# EAGLE design Duinopeak-Mazebot-v0.1 (EAGLE 6.6.0)
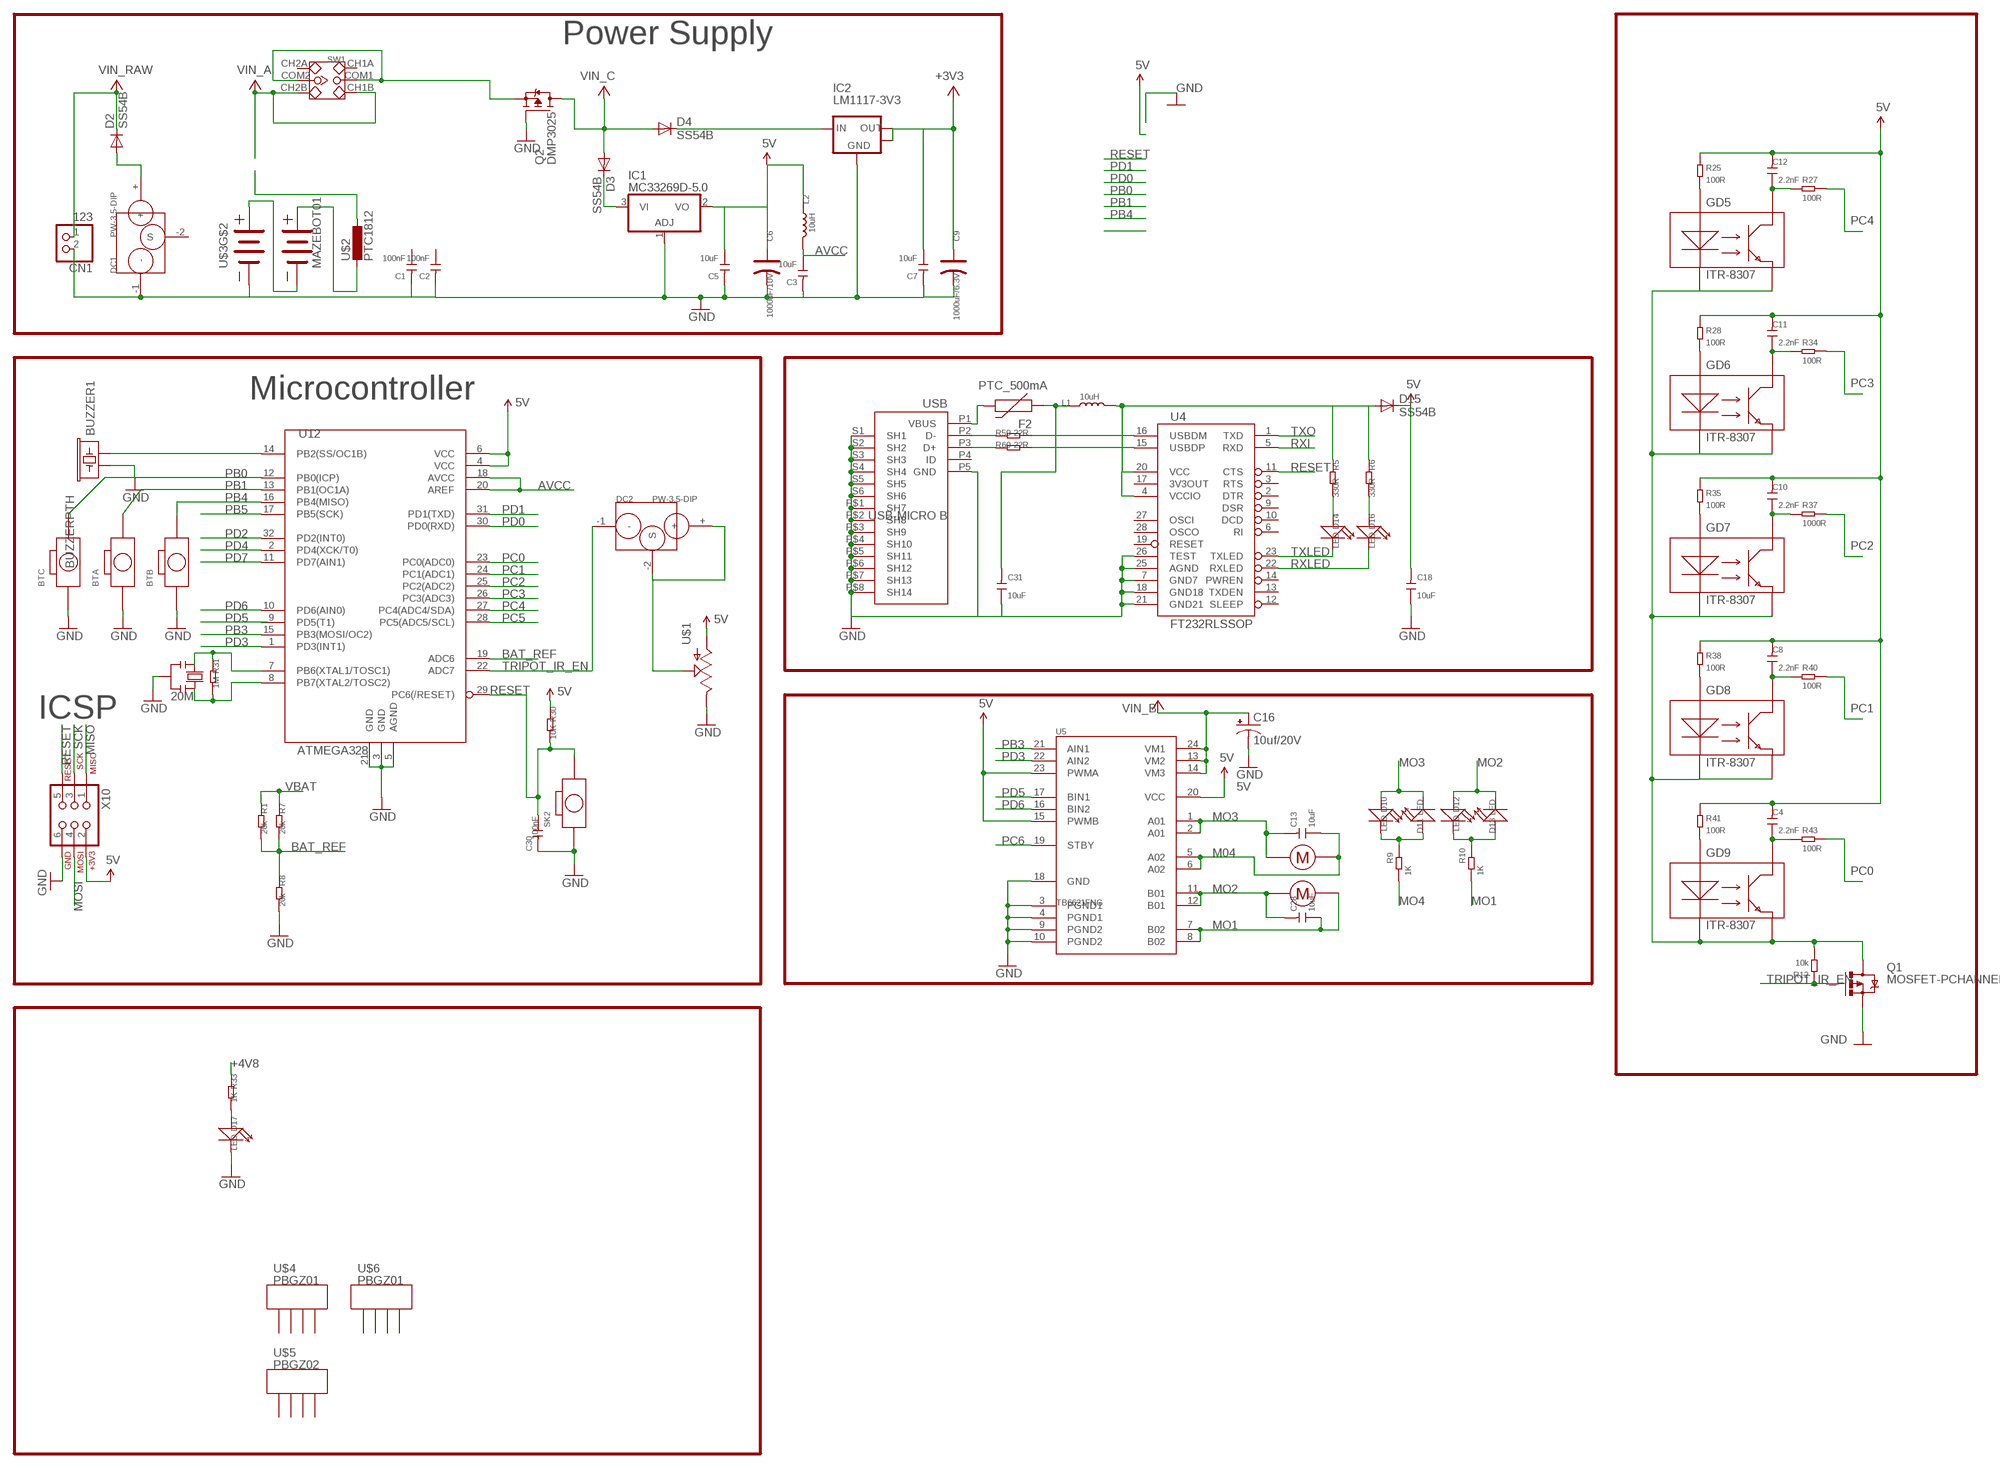
[diagram p0: schematic, sheet 1]

## Parts
BTA  BOTTON-2P-90  [2P-7.62X3.56-90D]
BTB  BOTTON-2P-90  [2P-7.62X3.56-90D]
BTC  BOTTON-2P-90  [2P-7.62X3.56-90D]
BUZZER1  BUZZERPTH  [BUZZER-12MM]
C1  100nF  C-0603  [C0603]
C2  100nF  C-0603  [C0603]
C3  10uF  C-0805  [C0805]
C4  2.2nF  C-0603  [C0603]
C5  10uF  C-0805  [C0805]
C6  1000uF/10V  CAP-D8.2/3.05  [ELECTRO-8.2MM]
C7  10uF  C-0805  [C0805]
C8  2.2nF  C-0603  [C0603]
C9  1000uF/6.3V  CAP-D8.2/3.05  [ELECTRO-8.2MM]
C10  2.2nF  C-0603  [C0603]
C11  2.2nF  C-0603  [C0603]
C12  2.2nF  C-0603  [C0603]
C13  10uF  C-0805  [C0805]
C16  10uf/20V  CAP_POL1206  [EIA3216]
C18  10uF  C-0603  [C0603]
C28  10uF  C-0805  [C0805]
C30  100nF  C-0603  [C0603]
C31  10uF  C-0805  [C0805]
CN1  123  JST_2PIN-SMT-RA  [JST-PH-2-SMT-RA]
D2  SS54B  DIODE-SMB  [SMB]
D3  SS54B  DIODE-SMB  [SMB]
D4  SS54B  DIODE-SMB  [SMB]
D10  LED  LED'0603'  [LED-0603]
D11  LED  LED'0603'  [LED-0603]
D12  LED  LED'0603'  [LED-0603]
D13  LED  LED'0603'  [LED-0603]
D14  LED  LED'0603'  [LED-0603]
D15  SS54B  DIODE-SMB  [SMB]
D16  LED  LED'0603'  [LED-0603]
D17  LED  LED'0603'  [LED-0603]
DC1  PW-3.5-DIP  [PW-3.5-DIP]
DC2  PW-3.5-DIP  [PW-3.5-DIP]
F2  PTC_500mA  PTCSMD  [PTC-1206]
GD5  ITR-8307  [ITR-8307]
GD6  ITR-8307  [ITR-8307]
GD7  ITR-8307  [ITR-8307]
GD8  ITR-8307  [ITR-8307]
GD9  ITR-8307  [ITR-8307]
IC1  MC33269D-5.0  MC33269D  [DPACK]
IC2  LM1117-3V3  LM1117-SOT223  [SOT223]
L1  10uH  L'0805'  [L0805]
L2  10uH  L'0805'  [L0805]
Q1  MOSFET-PCHANNEL  [SOT23]
Q2  DMP3025  SPD30P06PTO252  [TO252]
R1  20k  R-0603  [R0603]
R5  330R  R-0603  [R0603]
R6  330R  R-0603  [R0603]
R7  20k  R-0603  [R0603]
R8  20k  R-0603  [R0603]
R9  1K  R-0603  [R0603]
R10  1K  R-0603  [R0603]
R12  10k  R-0603  [R0603]
R25  100R  R-0603  [R0603]
R27  100R  R-0603  [R0603]
R28  100R  R-0603  [R0603]
R30  10K  R-0603  [R0603]
R31  1M  R-0603  [R0603]
R33  1K  R-0603  [R0603]
R34  100R  R-0603  [R0603]
R35  100R  R-0603  [R0603]
R37  1000R  R-0603  [R0603]
R38  100R  R-0603  [R0603]
R40  100R  R-0603  [R0603]
R41  100R  R-0603  [R0603]
R43  100R  R-0603  [R0603]
R59  22R  R-0603  [R0603]
R60  22R  R-0603  [R0603]
SK2  BOTTON-2P-90  [2P-7.62X3.56-90D]
SW1  SWITCH-2CH-6P'90D'  [6P-2CH-2.54-9.0X3.6-90D]
U4  FT232RLSSOP  [SSOP28DB]
U5  TB6621FNG  [SSOP24]
U12  ATMEGA328  ATMEGA168  [TQFP32-08]
U$1  POTTRIM  [TRIM_POT]
U$2  PTC1812  [PTC-L1812]
U$3  MAZEBOT01  [MAZEBOT-P1]
U$4  PBGZ01  [PBGZ-22X33MM]
U$5  PBGZ02  [PBGZ-20X55MM]
U$6  PBGZ01  [PBGZ-22X33MM]
USB  USB-MICRO B  MYCON2_USB-MINI-B  [CON2_USB_MICRO_B_AT]
X10  AVR_SPI_PRG_62X3_LOCK  [2X3_LOCK]
Y1  20M  RESONATORMU  [RESONATOR]

## Nets
5V: C4.2 C5.1 C6.1(+) C8.2 C10.2 C11.2 C12.2 C18.2 D15.C IC1.2(VO) L2.1 R25.1 R28.1 R30.1 R35.1 R38.1 R41.1 U5.15(PWMB) U5.20(VCC) U5.23(PWMA) U12.4(VCC) U12.6(VCC) U$1.3(A) X10.2
+3V3: C7.1 C9.1(+) IC2.2(OUT) IC2.4(OUT)
+4V8: R33.1
AVCC: C3.1 L2.2 U12.18(AVCC) U12.20(AREF)
BAT_REF: R1.2 R7.2 R8.1 U12.19(ADC6)
DCA: CN1.1 D2.C ; supply symbol labelled VIN_RAW
DCB: SW1.CH1B SW1.CH2B ; supply symbol labelled VIN_A
GND: BTA.P$1 BTB.P$1 BTC.P$1 BUZZER1.+ C1.2 C2.2 C3.2 C5.2 C6.2(-) C7.2 C9.2(-) C16.C(-) C18.1 C30.2 C31.1 CN1.2 D17.- DC1.-1(-) IC1.1(ADJ) IC2.1(GND) Q1.2(S) Q2.1(G) R8.2 SK2.P$1 U4.7(GND7) U4.18(GND18) U4.21(GND21) U4.25(AGND) U4.26(TEST) U5.3(PGND1) U5.4(PGND1) U5.9(PGND2) U5.10(PGND2) U5.18(GND) U12.3(GND) U12.5(AGND) U12.21(GND) U$1.2(E) U$3.D1 USB.P5(GND) USB.P$1(SH7) USB.P$2(SH8) USB.P$3(SH9) USB.P$4(SH10) USB.P$5(SH11) USB.P$6(SH12) USB.P$7(SH13) USB.P$8(SH14) USB.S1(SH1) USB.S2(SH2) USB.S3(SH3) USB.S4(SH4) USB.S5(SH5) USB.S6(SH6) X10.6 Y1.2
M04: C13.1 U5.5(A02) U5.6(A02) U$3.M2
MISO: X10.1
MO1: C28.1 R10.2 U5.7(B02) U5.8(B02) U$3.M4
MO2: C28.2 D12.+ D13.- U5.11(B01) U5.12(B01) U$3.M3
MO3: C13.2 D10.+ D11.- U5.1(A01) U5.2(A01) U$3.M1
MO4: R9.2
MOSI: X10.4
N$2: R31.1 U12.7(PB6(XTAL1/TOSC1)) Y1.1
N$3: R31.2 U12.8(PB7(XTAL2/TOSC2)) Y1.3
N$4: D14.+ R5.2
N$5: D16.+ R6.2
N$6: D10.- D11.+ R9.1
N$7: D17.+ R33.2
N$8: C31.2 F2.1 L1.1
N$9: GD5.2 GD5.4 GD6.2 GD6.4 GD7.2 GD7.4 GD8.2 GD8.4 GD9.2 GD9.4 Q1.3(D) R12.2
N$10: DC2.+ DC2.-2(S) U$1.1(S)
N$11: BUZZER1.- U12.14(PB2(SS/OC1B))
N$13: D12.- D13.+ R10.1
N$20: C12.1 GD5.3 R27.2
N$21: U$3.D2 U$3.D3
N$22: U$2.1 U$3.D4
N$28: D4.C IC2.3(IN)
N$30: D3.C IC1.3(VI)
N$32: F2.2 USB.P1(VBUS)
N$33: R59.1 USB.P2(D-)
N$34: GD5.1 R25.2
N$35: GD6.1 R28.2
N$36: C10.1 GD7.3 R37.2
N$40: GD7.1 R35.2
N$46: C8.1 GD8.3 R40.2
N$47: D15.A L1.2 R5.1 R6.1 U4.4(VCCIO) U4.20(VCC)
N$50: GD8.1 R38.2
N$51: C4.1 GD9.3 R43.2
N$55: GD9.1 R41.2
N$61: U$2.2
N$62: R60.1 USB.P3(D+)
N$66: D2.A DC1.+
N$73: C11.1 GD6.3 R34.2
PB0: BTC.P$2 U12.12(PB0(ICP))
PB1: BTA.P$2 U12.13(PB1(OC1A))
PB3: U5.21(AIN1) U12.15(PB3(MOSI/OC2))
PB4: BTB.P$2 U12.16(PB4(MISO))
PB5: U12.17(PB5(SCK))
PC0: R43.1 U12.23(PC0(ADC0))
PC1: R40.1 U12.24(PC1(ADC1))
PC2: R37.1 U12.25(PC2(ADC2))
PC3: R34.1 U12.26(PC3(ADC3))
PC4: R27.1 U12.27(PC4(ADC4/SDA))
PC5: U12.28(PC5(ADC5/SCL))
PC6: U5.19(STBY)
PD0: U12.30(PD0(RXD))
PD1: U12.31(PD1(TXD))
PD2: U12.32(PD2(INT0))
PD3: U5.22(AIN2) U12.1(PD3(INT1))
PD4: U12.2(PD4(XCK/T0))
PD5: U5.17(BIN1)
PD6: U5.16(BIN2) U12.10(PD6(AIN0))
PD7: U12.11(PD7(AIN1))
RESET: C30.1 R30.2 SK2.P$2 U4.11(CTS) U12.29(PC6(/RESET)) X10.5
RXI: U4.5(RXD)
RXLED: D16.- U4.22(RXLED)
SCK: X10.3
TRIPOT_IR_EN: DC2.-1(-) Q1.1(G) R12.1 U12.22(ADC7)
TXLED: D14.- U4.23(TXLED)
TXO: U4.1(TXD)
USB_D+: R60.2 U4.15(USBDP)
USB_D-: R59.2 U4.16(USBDM)
VBAT: R1.1 R7.1
VIN_B: Q2.2(S) SW1.COM1 SW1.COM2
VIN_C: C16.A(+) D3.A D4.A Q2.3(D) U5.13(VM2) U5.14(VM3) U5.24(VM1) ; supply symbol labelled VIN_B
Unconnected: C1.1 C2.1 DC1.-2(S) SW1.CH1A SW1.CH2A U4.2(DTR) U4.3(RTS) U4.6(RI) U4.9(DSR) U4.10(DCD) U4.12(SLEEP) U4.13(TXDEN) U4.14(PWREN) U4.17(3V3OUT) U4.19(RESET) U4.27(OSCI) U4.28(OSCO) U12.9(PD5(T1)) U$3.1(GND) U$3.2(+5V) U$3.3(+3.3V) U$3.4(RESET) U$3.5(TXD) U$3.6(RXD) U$3.7(PB2) U$3.8(MOSI) U$3.9(MISO) U$3.10(SCK) U$3.11(PC7) U$3.12(PC6) U$3.13(PC5) U$3.14(PC4) U$3.15(PC3) U$3.16(PC2) U$3.17(SDA) U$3.18(SCL) U$3.19(PA7) U$3.20(PD5) U$4.1 U$4.2 U$4.3 U$4.4 U$5.1 U$5.2 U$5.3 U$5.4 U$6.1 U$6.2 U$6.3 U$6.4 USB.P4(ID)

## Notes on the sheet
- Power Supply
- Microcontroller
- ICSP

## Library data of the parts
BTA BTB BTC SK2 = Seeedstudio-Discrete.rpt:BOTTON-2P
BUZZER1 = SparkFun:BUZZER: Buzzer 12mm Spark Fun Electronics SKU : Comp-Buzzer
C1-C5 C7 C8 C10-C13 C18 C28 C30 C31 = Discrete:C*: Ceramic Capacitors
C6 C9 = Discrete:CAP*: Electrolytic Capacitors,Tantalum Capacitors and Super Capacitors
C16 = SparkFun:CAP_POL: Capacitor Polarized These are standard SMD and PTH capacitors. Normally 10uF, 47uF, and 100uF in electrolytic and tantalum varieties. Always verify the external diameter of the through hole cap, it varies with capacity, voltage, and manufacturer. The EIA devices should be standard.
CN1 = adafruit:JST_2PIN: JST 2-Pin Connectors of various flavors SMT-RA (S2B-PH-SM4) 4UConnector #17311 SMT (B2B-PH-SM4) THM-RA (S2B-PH) THM (B2B-PH)
D2-D4 D15 = diode:DIODE-: DIODE
D10-D14 D16 D17 = Discrete:LED*
DC1 DC2 = arduino-QXZ:PW-3.5-DIP
F2 = SparkFun:PTC: Resettable Fuse PTC Resettable Fuse. Spark Fun Electronics SKU : COM-08357
GD5-GD9 = arduino-QXZ:ITR-8307
IC1 = linear:MC33269?*: Adjustable Output Low Dropout Voltage Regulator 800 mA Source: http://www.onsemi.com/pub/Collateral/MC33269-D.PDF
IC2 = TKJMixed:LM1117: Voltage Regulator LM1117 Standard adjustable voltage regulator but in SMD form. Spark Fun Electronics SKU : COM-00595
L1 L2 = Discrete:L*
Q1 = SparkFun:MOSFET-PCHANNEL
Q2 = transistor-fet:SPD30P06P: SIPMOS(R) Power-Transistor P-Channel, Enhancement mode Source: http://www.infineon.com/upload/Document/cmc_upload/documents/012/3615/SPD_U30P06P.pdf
R1 R5-R10 R12 R25 R27 R28 R30 R31 R33-R35 R37 R38 R40 R41 R43 R59 R60 = Discrete:R*
SW1 = Seeedstudio-Discrete.rpt:SWITCH-2CH-6P
U4 = SparkFun:FT232RL: USB UART FT232RL 4th Generation USB UART (USB <-> Serial) Controller. Spark Fun Electronics SKU : COM-00650
U5 = SparkFun:TB6621FNG: Toshiba 1A motor driver
U12 = SparkFun:ATMEGA168
U$1 = SparkFun:POT
U$2 = arduino-QXZ:PTC
U$3 = 元件库-模块板:MAZEBOT
U$4-U$6 = 元件库-main:PBGZ
USB = SmartPrj:MYCON2_USB-MINI-B
X10 = TKJMixed:AVR_SPI_PRG_6: AVR ISP 6 Pin This is the reduced ISP connector for AVR programming. Common on Arduino. This footprint will take up less PCB space and can be used with a 10-pin to 6-pin adapter such as SKU: BOB-08508
Y1 = SmartPrj:RESONATOR

## Net classes
0 default: width 0.203 mm
1 vcc: width 0.254 mm

## Board
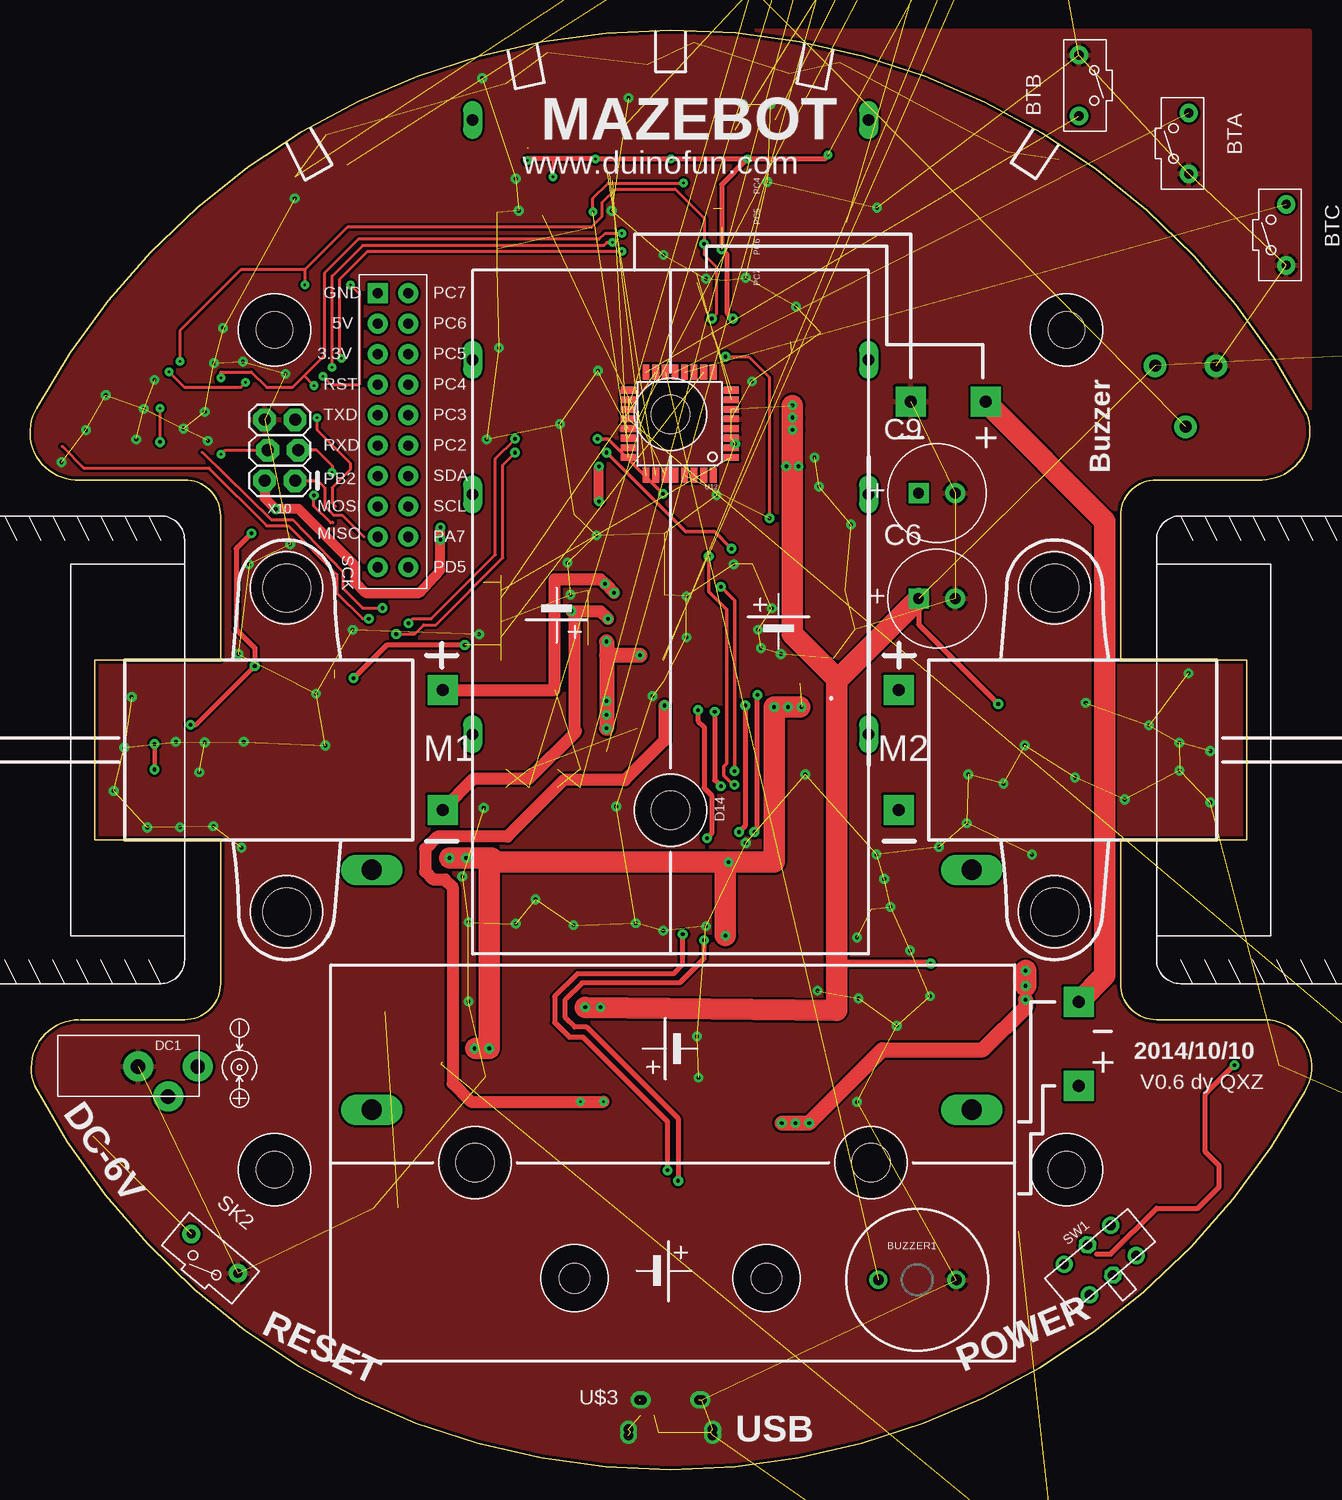
[diagram p1: board, top side]
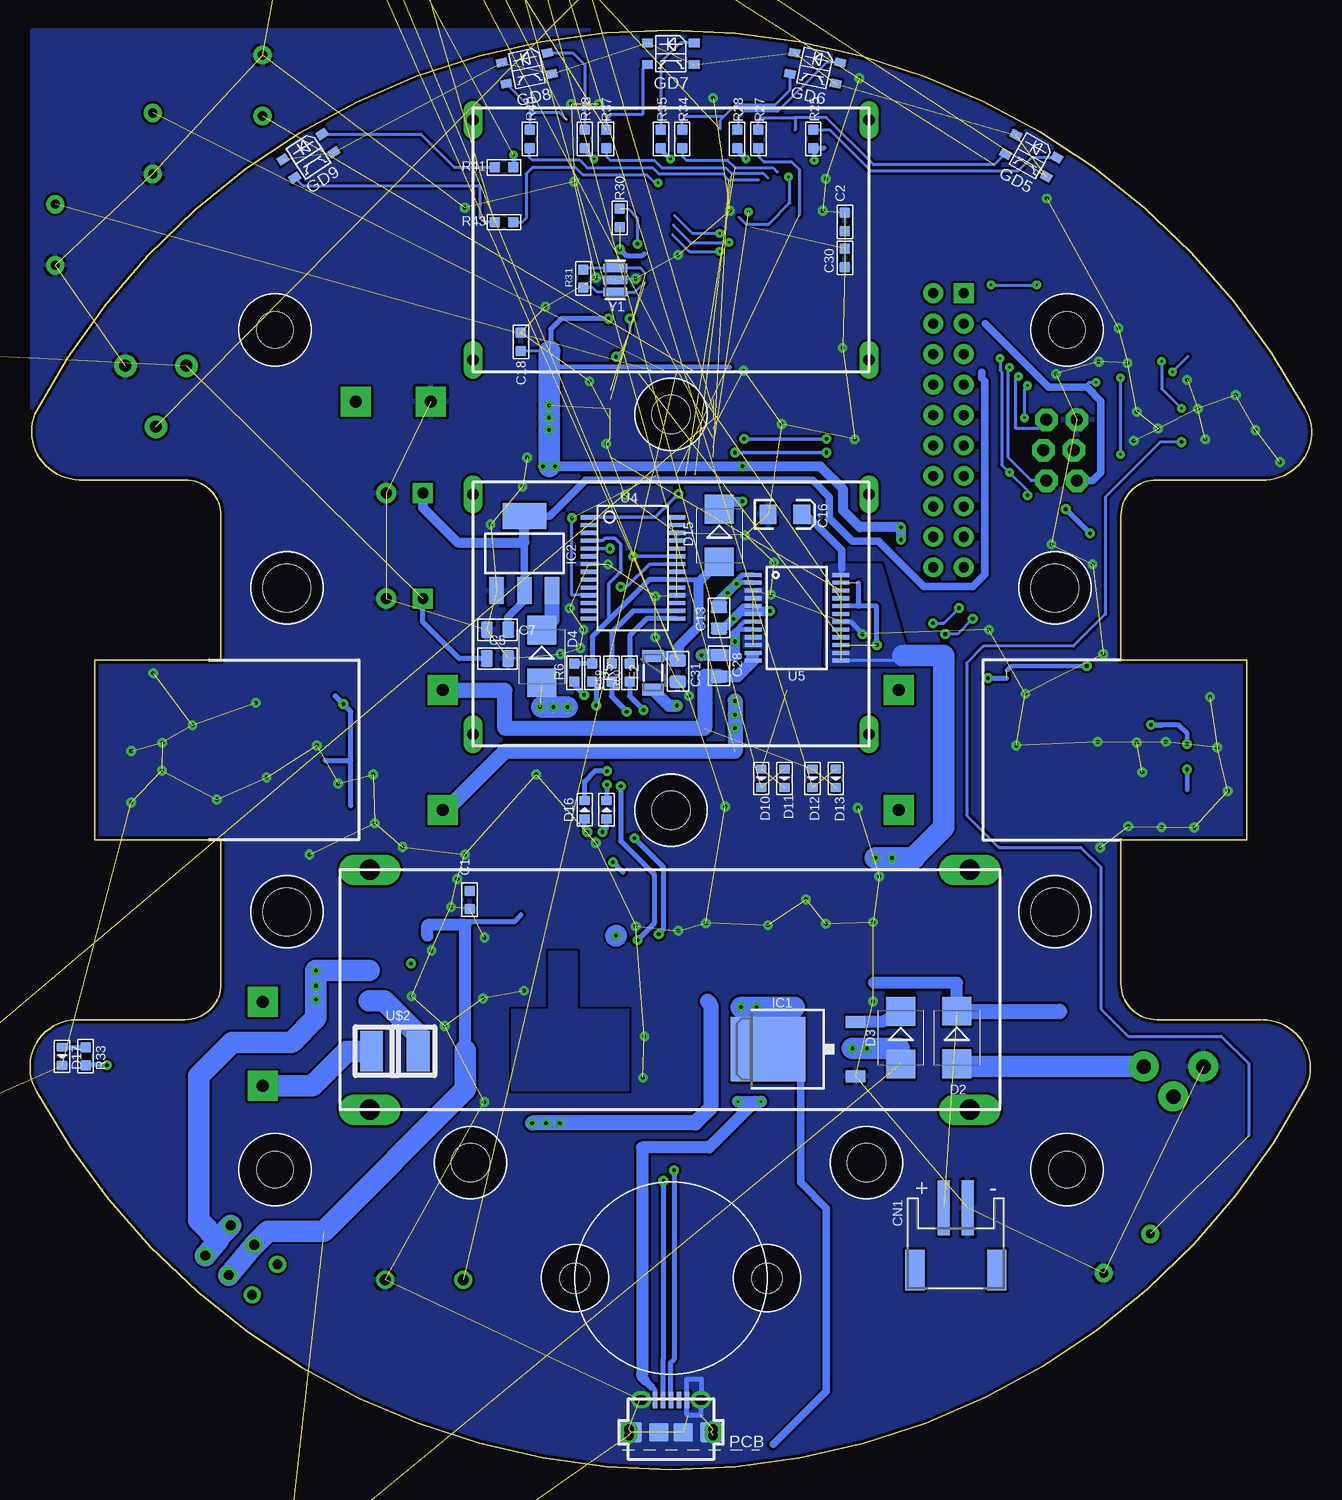
[diagram p2: board, bottom side, seen from below]

Size 106.79 x 120 mm. Coordinates in mm from the lower left corner, seen from the top.
Copper layers (1*16): Top 0.035mm / dielectric 1.5mm / Bottom 0.035mm
Design rules "Sparkfun *": minimum track width 10mil, minimum drill 12mil, track to track 8mil, track to pad 8mil, pad to pad 8mil, via to via 8mil, smd to smd 8mil, copper to edge 10mil, drill to drill 8mil, minimum pad ring 12mil, minimum via ring 10mil, stop-mask expansion 4mil, vias tented up to drill 25mil, thermal gap 10mil

### Footprints (pad centres in the part's own frame; a part is rotated, then mirrored left to right if it is on the bottom)
2P-7.62X3.56-90D = drill 0.762 pad 1.524: P$1 0,2.54; P$2 0,-2.54
BUZZER-12MM = drill 0.9: + 3.25,0; - -3.25,0
C0603 = smd 0.889 x 0.889: 1 -0.762,0; 2 0.762,0
C0805 = smd 1.016 x 1.397: 1 -0.889,0; 2 0.889,0
ELECTRO-8.2MM = drill 0.889 pad 1.651 square: 1 -1.524,0 | drill 0.889 pad 1.651: 2 1.524,0
EIA3216 = smd 1.4 x 1.6: A 1.4,0; C -1.4,0
JST-PH-2-SMT-RA = smd 1 x 4.6: 1 1,-3.7; 2 -1,-3.7 | smd 1.6 x 3.4: NC1 -3.4,1.5; NC2 3.4,1.5
SMB = smd 2.4 x 2.4: A 2.2,0; C -2.2,0
LED-0603 = smd 0.762 x 0.889: + -0.762,0; - 0.762,0
PW-3.5-DIP = drill 1.2 pad 2.5: + -0.025,0; -1 -5,0; -2 -2.5,-2.5
PTC-1206 = smd 1 x 1.8: 1 -1.4,0; 2 1.4,0
ITR-8307 = smd 0.9 x 0.7: 1 1.947,0.918; 2 -1.953,0.918; 3 -1.953,-0.882; 4 1.947,-0.882
DPACK = smd 1 x 1.6: 1 -2.28,-4.8; 3 2.28,-4.8 | smd 5.4 x 6.2: 2 0,2.5
SOT223 = smd 1.219 x 2.235: 1 -2.311,-3.099; 2 0,-3.099; 3 2.311,-3.099 | smd 3.6 x 2.2: 4 0,3.099
L0805 = smd 1.016 x 1.397: 1 -0.889,0; 2 0.889,0
SOT23 = smd 1 x 1.4: 1 -0.95,-1.1; 2 0.95,-1.1; 3 0,1.1
TO252 = smd 1 x 1.6: 1 -2.28,-4.8; 2 2.28,-4.8 | smd 5.4 x 6.2: 3 0,2.5
R0603 = smd 0.889 x 0.889: 1 -0.762,0; 2 0.762,0
6P-2CH-2.54-9.0X3.6-90D = drill 0.813 pad 1.27: CH1A -2.54,-1.65; CH1B 2.54,-1.65; CH2A -2.54,1.65; CH2B 2.54,1.65 | drill 0.813 pad 1.27 octagon: COM1 0,-1.65; COM2 0,1.65
SSOP28DB = smd 0.348 x 1.397: 1 -4.225,-3.656; 2 -3.575,-3.656; 3 -2.925,-3.656; 4 -2.275,-3.656; 5 -1.625,-3.656; 6 -0.975,-3.656; 7 -0.325,-3.656; 8 0.325,-3.656; 9 0.975,-3.656; 10 1.625,-3.656; 11 2.275,-3.656; 12 2.925,-3.656; 13 3.575,-3.656; 14 4.225,-3.656; 15 4.225,3.656; 16 3.575,3.656; 17 2.925,3.656; 18 2.275,3.656; 19 1.625,3.656; 20 0.975,3.656; 21 0.325,3.656; 22 -0.325,3.656; 23 -0.975,3.656; 24 -1.625,3.656; 25 -2.275,3.656; 26 -2.925,3.656; 27 -3.575,3.656; 28 -4.225,3.656
SSOP24 = smd 0.348 x 1.397: 1 -3.575,-3.656; 2 -2.925,-3.656; 3 -2.275,-3.656; 4 -1.625,-3.656; 5 -0.975,-3.656; 6 -0.325,-3.656; 7 0.325,-3.656; 8 0.975,-3.656; 9 1.625,-3.656; 10 2.275,-3.656; 11 2.925,-3.656; 12 3.575,-3.656; 13 3.575,3.656; 14 2.925,3.656; 15 2.275,3.656; 16 1.625,3.656; 17 0.975,3.656; 18 0.325,3.656; 19 -0.325,3.656; 20 -0.975,3.656; 21 -1.625,3.656; 22 -2.275,3.656; 23 -2.925,3.656; 24 -3.575,3.656
TQFP32-08 = smd 1.27 x 0.559: 1 -4.293,2.8; 2 -4.293,2; 3 -4.293,1.2; 4 -4.293,0.4; 5 -4.293,-0.4; 6 -4.293,-1.2; 7 -4.293,-2; 8 -4.293,-2.8; 17 4.293,-2.8; 18 4.293,-2; 19 4.293,-1.2; 20 4.293,-0.4; 21 4.293,0.4; 22 4.293,1.2; 23 4.293,2; 24 4.293,2.8 | smd 0.559 x 1.27: 9 -2.8,-4.293; 10 -2,-4.293; 11 -1.2,-4.293; 12 -0.4,-4.293; 13 0.4,-4.293; 14 1.2,-4.293; 15 2,-4.293; 16 2.8,-4.293; 25 2.8,4.293; 26 2,4.293; 27 1.2,4.293; 28 0.4,4.293; 29 -0.4,4.293; 30 -1.2,4.293; 31 -2,4.293; 32 -2.8,4.293
TRIM_POT = drill 1 pad 1.88: 1 5.08,0; 2 0,2.54; 3 0,-2.54
PTC-L1812 = smd 1.9 x 3.4: 1 -1.95,0; 2 1.95,0
MAZEBOT-P1 = drill 0.838 pad 1.651 square: 1 -24.396,38.068 | drill 0.838 pad 1.651: 2 -24.396,35.528; 3 -24.396,32.988; 4 -24.396,30.448; 5 -24.396,27.908; 6 -24.396,25.368; 7 -24.396,22.828; 8 -24.396,20.288; 9 -24.396,17.748; 10 -24.396,15.208; 11 -21.856,38.068; 12 -21.856,35.528; 13 -21.856,32.988; 14 -21.856,30.448; 15 -21.856,27.908; 16 -21.856,25.368; 17 -21.856,22.828; 18 -21.856,20.288; 19 -21.856,17.748; 20 -21.856,15.208 | drill 1 pad 2.5 square: D1 20,29.016; D2 26.254,29.016; D3 34,-21; D4 34,-28; M1 -19,5; M2 -19,-5; M3 19,5; M4 19,-5 | hole 4: 32.01,13.48; 32.01,-13.52; -31.99,-13.52; -31.99,13.48 | hole 3: -33,35; 33,35; 33,-35; -33,-35 | hole 3.2: -16.3,-34.43; 16.7,-34.43; 0,-5.04; 0,27.96 | hole 2.5: -8,-44.052; 8,-44.052
PBGZ-22X33MM = drill 0.965 pad 1.27 long: 1 0,21; 2 0,1; 3 33,1; 4 33,21
PBGZ-20X55MM = drill 1.7 pad 2.2 long: 1 2.5,0; 2 2.5,20; 3 52.5,20; 4 52.5,0
CON2_USB_MICRO_B_AT = smd 0.406 x 1.346: P1 -1.321,2.692; P2 -0.66,2.692; P3 0,2.692; P4 0.66,2.692; P5 1.321,2.692 | drill 0.8 pad 1.27: P$1 -2.616,2.692 | drill 0.8 pad 1.245: P$2 -2.362,2.692; P$7 2.362,2.692; P$8 2.616,2.692 | drill 0.8 pad 1.143: P$3 -3.505,-0.254; P$4 -3.505,0.254; P$5 3.505,0.254; P$6 3.505,-0.254 | smd 1.778 x 1.651: S1 -3.302,0; S2 3.302,0 | smd 1.524 x 1.27: S3 -2.489,2.692; S4 2.489,2.692 | smd 1.626 x 1.524: S5 -1.016,0; S6 1.016,0
2X3_LOCK = drill 1.016 pad 1.88 octagon: 1 0,0; 2 0,2.54; 3 2.54,-0.254; 4 2.54,2.286; 5 5.08,0; 6 5.08,2.54
RESONATOR = smd 0.7 x 2: 1 -1,0; 2 0,0; 3 1,0

### Placement (x,y rotation side)
BTA  96.56,110.55 180 top
BTB  87.41,115.37 0 top
BTC  104.69,102.93 180 top
BUZZER1  73.95,15.8 0 top
C1  70.16,47.48 270 bottom
C2  38.88,104 90 bottom
C3  126.53,23.42 0 top  (outside the outline)
C4  85.38,161.09 0 top  (outside the outline)
C5  67.84,67.6 0 bottom
C6  75.58,72.6 0 top
C7  67.83,70.01 180 bottom
C8  85.38,157.28 0 top  (outside the outline)
C9  75.58,81.4 0 top
C10  85.38,153.47 0 top  (outside the outline)
C11  85.38,149.66 0 top  (outside the outline)
C12  85.38,145.85 0 top  (outside the outline)
C13  49.38,71 90 bottom
C16  43.89,79.63 0 bottom
C18  65.88,94 270 bottom
C28  49.38,67 270 bottom
C30  38.88,101 270 bottom
C31  52.81,66.56 90 bottom
CN1  29.64,18.12 180 bottom
D2  29.56,36 270 bottom
D3  34.24,36 270 bottom
D4  64.15,67.78 270 bottom
D10  45.86,57.62 270 bottom
D11  43.92,57.62 270 bottom
D12  41.58,57.62 270 bottom
D13  39.65,57.62 270 bottom
D14  58.75,55 90 bottom
D15  49.36,77.86 270 bottom
D16  60.57,55 90 bottom
D17  104.12,34.45 270 bottom
DC1  14.01,33.58 0 top
DC2  35.09,148.9 0 top  (outside the outline)
F2  54.89,66.42 270 bottom
GD5  23.38,109.5 331 bottom
GD6  41.38,116.8 348 bottom
GD7  53.38,118 0 bottom
GD8  65.38,116.8 12 bottom
GD9  83.58,109.5 33 bottom
IC1  42.8,35.04 90 bottom
IC2  65.59,76.38 0 bottom
L1  82.84,137.72 0 top  (outside the outline)
L2  124.24,93.53 0 top  (outside the outline)
Q1  81.57,145.85 0 top  (outside the outline)
Q2  83.86,-9.6 0 top  (outside the outline)
R1  85.38,211.64 0 top  (outside the outline)
R5  59.93,66.43 270 bottom
R6  61.43,66.43 270 bottom
R7  85.38,207.83 0 top  (outside the outline)
R8  85.38,204.02 0 top  (outside the outline)
R9  85.38,200.21 0 top  (outside the outline)
R10  85.38,196.4 0 top  (outside the outline)
R12  82.33,142.04 0 top  (outside the outline)
R25  41.52,110.91 90 bottom
R27  46.09,110.91 90 bottom
R28  47.87,110.91 90 bottom
R30  57.64,104.34 90 bottom
R31  60.69,99.28 270 bottom
R33  102.16,34.45 90 bottom
R34  52.44,110.91 90 bottom
R35  54.22,110.91 90 bottom
R37  58.79,110.91 90 bottom
R38  60.57,110.91 90 bottom
R40  65.14,110.91 90 bottom
R41  67.29,108.55 180 bottom
R43  67.29,103.97 180 bottom
R59  58.33,66.43 90 bottom
R60  56.83,66.43 90 bottom
SK2  15.38,18 230 top
SW1  89.18,17.46 40 top
U4  56.56,75.16 270 bottom
U5  42.88,71 270 bottom
U12  54.14,87.18 180 top
U$1  96.3,92 270 top
U$2  76.38,34.87 0 bottom
U$3  53.38,60 0 top
U$4  36.88,113.5 180 bottom
U$5  25.98,50 180 bottom
U$6  36.88,82.3 180 bottom
USB  53.38,3.1 0 bottom
X10  22.1,82.43 90 top
Y1  58.02,99.15 270 bottom

### Tracks (layer width: path | path; a pad name or v marks a point on that pad's centre or on a via)
5V  (via drill 0.2, 0.2 pad 0.3, 0.3, 0.3 pad 0.41)  (15 unrouted)
  Top 0.254: 41.44,109.25 v41.44,109.12 | v43.6,107.75 43.6,109.25 | v11.6,91.5 12.87,90.23 17.56,90.23 v17.95,90.61
  Top 0.381: v10.38,60.48 v10.38,58.35 | v18.73,66.98 13.83,62.08 v13.37,62.08
  Top 0.406: 41.44,109.25 43.6,109.25 v47.13,109.25 v53.43,109.25 v59.78,109.25 | v59.78,109.25 66.23,109.25 66.48,109.5 v66.48,109.58 | v36.23,68.72 29.72,68.72 v26.96,65.97 | C6.1 74.05,70.44 v80.68,63.81 | v58.59,95.94 58.08,96.45 58.08,101.29 v57.64,101.73 57.64,107.11 v59.78,109.25 | v18.45,78.03 17.18,76.76 17.18,70.03 18.73,68.48 v18.73,66.98
  Top 0.61: v75.05,42.18 67.56,42.18 arc90 67.22,41.84
  Top 0.813: X10.2 19.56,81 v20.49,80.07 22.39,80.07 27.09,75.37 27.09,73.97 27.98,73.08 32.42,73.08 34.2,74.99 v34.2,77.53 v34.2,78.54 | v47.41,80.7 v47.41,83.62
  Top 1.778: v46.27,38.54 67.22,38.28 67.22,41.84 67.22,65.77 67.32,65.87 | 67.32,65.87 C6.1 | v63.54,88.7 v63.54,87.69 v63.54,86.67 63.54,69.65 67.32,65.87
  Bottom 0.254: 47.87,109.99 R28.1 | 66.48,108.59 R41.1 | R38.1 60.57,110.04 | R35.1 54.22,110.04 | 47.71,104.37 47.16,103.81 45.25,103.81 43.47,105.59 43.47,107.62 v43.6,107.75 | 63.48,93.24 C18.2 | 10.31,92.78 v11.6,91.5 | v17.95,90.61 18.58,90.61 18.96,90.23
  Bottom 0.381: 10.38,61.34 v10.38,60.48 | v10.38,58.35 10.38,56.66 | 25.38,66.66 25.36,66.66 25.03,66.98 v18.73,66.98
  Bottom 0.406: R25.1 40.64,110.15 | 41.44,110.15 v41.44,109.12 | v47.13,109.25 47.87,109.99 | v66.48,109.58 66.48,108.59 | 60.57,110.04 v59.78,109.25 | 54.22,110.04 v53.43,109.25 | C5.1 71.01,67.6 74.05,70.64 C6.1 | v36.23,68.72 36.23,71.97 37.76,71.97 | 37.76,71.97 U5.20 | 37.76,73.92 37.76,71.97 | v26.96,65.97 25.41,65.97 | 48.51,91.88 63.28,91.88 | 55.59,101.35 55.79,101.15 57.06,101.15 v57.64,101.73 | v58.59,95.94 62.52,95.94 63.41,95.05 63.41,94.03 | 80.05,55.33 80.05,59.11 | 80.05,59.11 80.05,63.17 v80.68,63.81 81.38,64.5 | 82.23,59.11 80.05,59.11 | v20.49,80.07 v18.45,78.03 | 10.38,61.34 11.12,62.08 v13.37,62.08 12.38,62.08
  Bottom 0.61: 27.18,95.53 21.88,90.23 18.96,90.23 18.71,90.23 17.56,89.08 17.56,83.11 18.24,82.44 X10.2 | 44.87,2.09 40.42,6.53 40.42,21.77 42.58,23.93 42.58,32.7 44.93,35.04 IC1.2 | 63.28,91.88 63.54,92.13 63.54,92.89
  Bottom 0.813: v64.05,83.62 63.54,83.62 v63.03,83.62 v47.41,83.62 40.93,83.62 39.03,81.72 39.03,79.94 37.63,78.54 v34.2,78.54 v34.2,77.53 | D15.C 48.73,80.7 v47.41,80.7
  Bottom 1.778: IC1.2 45.3,36.08 43.09,38.54 v46.27,38.54 v47.54,38.54 | 63.48,93.24 63.54,93.18 63.54,92.89 v63.54,88.7 v63.54,87.69 v63.54,86.67 63.54,83.62
+3V3
  Bottom 0.254: 27.49,91.5 27.47,91.5 | 27.47,90.99 27.22,90.73
  Bottom 0.61: 27.47,91.5 27.47,90.99 | 27.22,90.73 27.22,74.61 28.23,73.59 32.3,73.59 36.11,77.4 38.27,77.4 40.17,79.3 40.17,81.08 41.57,82.48 60.49,82.48 63.49,79.48 IC2.4 IC2.2 65.59,72.42 66.97,71.05 66.97,70.04 C7.1
  Bottom 0.813: C9.1 74.05,80.17 71.16,77.27 65.59,77.27 IC2.4
+4V8  (via drill 0.3)
  Top 0.406: 88.88,17.96 90.08,17.96 93.89,21.77 97.32,21.77 99.1,23.55 99.1,25.33 97.96,26.47 97.96,31.3 v100.37,33.71
  Bottom 0.406: v100.37,33.71 102.13,33.71 R33.1
AVCC  (3 unrouted)
BAT_REF  (3 unrouted)
DCA  (1 unrouted)
  Bottom 1.016: D2.C 29.56,40.57 36.48,40.57
  Bottom 1.27: D2.C 20.99,38.2 20.99,38.16
DCB  (via drill 0.3 pad 0.41)
  Top 1.27: v62.65,28.89 v63.79,28.89 v64.94,28.89 71.03,34.98 79.41,34.98 82.97,38.54 v82.97,39.17
  Top 1.778: v82.97,41.59 v82.97,40.31
  Bottom 0.406: 78.53,41.71 78.65,41.59
  Bottom 1.27: 50.35,39.05 50.08,38.77 50.08,30.16 51.35,28.89 v64.94,28.89
  Bottom 1.778: 78.53,41.59 78.65,41.59 v82.97,41.59 v82.97,40.31 v82.97,39.17 82.97,37.65 85,35.62 89.95,35.62 92.75,32.82 92.75,20.76 91.1,19.11 | 91.1,19.11 91.1,19.33 SW1.CH2B | SW1.CH1B 91.1,19.11
GND  (via drill 0.3 pad 0.41)  (158 unrouted)
  Bottom 0.305: U5.18 38.4,70.67
  Bottom 0.406: USB.S4 50.84,5.8 50.84,7.55 52.06,7.55 USB.P5 52.06,4.58 51.98,4.5 50.89,4.5 USB.S4 | USB.S4 USB.P$7 | 38.4,70.67 v37.43,69.63
  other vias: 98.36,59.9 95.77,60.58 95.8,58.27 98.36,55.61 93.26,62.03 87.97,63.91 96.53,66.38 82.89,60.36 14.11,58.12 12.15,60.66 14.57,60.61 17.82,60.66 7.86,60.18 9.77,53.52 15.28,53.62 12.51,53.55 8.47,64.39 6.97,56.57 37.68,115.98 22.06,105.95 49.87,114.33 59.4,113.82 61.68,113.82 63.84,96.93 70.57,105.19 61.43,107.35 52.79,101.25 58.76,85.5 47.33,91.6 44.16,87.15 47.21,77.88 45.05,72.93 44.79,75.6 17.74,92.36 21.3,91.34 16.09,95.15 15.33,92.23 12.79,86.77 4.66,86.64 8.85,85.88 9.49,88.42 6.31,89.57 2.63,83.98 14.57,88.17 14.82,85.76 10.38,90.84 18.25,75.47 21.68,77.12 17.36,67.98 26.89,70.01 24.6,60.36 23.84,64.67 17.62,51.85 37.81,55.15 60.16,90.71 65.75,81.95 65.37,84.36 68.42,78.77 54.7,72.8 54.7,69.37 58.64,75.47 61.81,71.79 60.67,70.01 60.92,68.48 62.57,67.98 64.61,57.94 59.65,52.23 48.86,55.28 68.92,44.35 71.72,46.89 72.23,36.99 69.05,39.27 68.92,30.64 55.59,36.1 55.72,32.67 42.13,47.53 45.3,45.37 40.48,45.5 36.54,45.62 36.54,39.02 36.03,49.43 65.62,39.91 78.19,57.94 81.12,57.18 78.07,53.88 87.08,57.69 91.22,55.86 83.5,51.26 75.76,51.9 70.55,51.26 71.18,49.23 73.34,43.26 74.99,39.45 50.48,45.55 52.77,44.91 56.32,45.29 51.88,64.47 57.21,81.23 56.32,99.27 59.65,99.34 48.48,104.93 40.73,104.93 40.48,107.6 38.06,85.88 39.08,93.5
  pour Bottom (rank 2, no thermals): 36.87,76.64 36.87,65.59 47.41,65.59 47.41,76.64
  pour Top: 53.38,119.94 106.59,119.94 106.59,85.91 106.72,32.57 106.72,-0.07 53.25,-0.07 0.04,-0.07 0.04,86.54 0.04,119.94
  pour Bottom (rank 3): 53.38,119.94 106.59,119.94 106.59,85.91 106.72,32.57 106.72,-0.07 53.25,-0.07 0.04,-0.07 0.04,86.54 0.04,119.94
M04  (via drill 0.3 pad 0.41)
  Top 1.016: U$3.M2 36.97,57.59 41.57,57.59 45.5,61.52 45.38,61.65 45.38,71.3 arc90 v45.12,71.56 47.54,71.56 v48.17,70.92
  Bottom 0.406: U5.5 47.37,71.97 48.93,70.41 49.08,70.41 C13.1 48.77,70.11 47.56,71.33 | U5.6 47.56,71.33 | 47.56,71.33 47.33,71.56 46.14,71.56
  Bottom 0.813: 46.14,71.56 v45.12,71.56
MISO  (via drill 0.2, 0.2 pad 0.3)
  Top 0.254: v48.55,102.29 48.04,102.29 47.79,102.04 27.72,102.04 25.18,99.5 v25.18,91.88 | X10.1 23.96,82.44 24.55,81.84 24.55,80.32 25.31,79.56 26.04,79.56 27.85,77.75
  Bottom 0.254: 53.18,103.75 51.73,102.29 v48.55,102.29 | X10.1 23.36,82.44 25.31,84.38 25.31,91.75 v25.18,91.88
MO1  (via drill 0.3 pad 0.41)  (1 unrouted)
  Top 1.27: v48.04,69.02 48.04,67.87 | 48.04,67.87 v48.04,61.78 | v50.84,67.87 48.04,67.87
  Bottom 0.356: U5.7 47.28,70.67 48.04,69.91
  Bottom 0.406: 48.92,68.02 C28.1 | U5.8 47.67,70.03 48.04,69.65 48.04,69.91
  Bottom 0.813: 48.04,67.89 48.04,69.65
  Bottom 1.016: 48.04,67.89 C28.1 50.82,67.89 v50.84,67.87
  Bottom 1.27: U$3.M4 71.87,55.22 67.22,59.87 48.04,59.87 v48.04,61.78 v48.04,62.92 v48.04,64.06
MO2  (2 unrouted)
  Bottom 0.254: U5.11 U5.12
  Bottom 1.016: C28.2 47.85,66.11 U5.12 46.53,67.75 46.65,67.75
  Bottom 1.27: U$3.M3 72.33,64.95 67.22,64.95 67.22,61.78 50.58,61.78 50.58,66.11 C28.2
MO3  (via drill 0.3 pad 0.41)  (2 unrouted)
  Top 0.254: 47.54,74.22 47.73,74.03 47.73,73.78
  Top 1.016: U$3.M1 43.73,65 43.73,74.22 47.54,74.22 v47.92,73.84 v48.68,73.08
  Bottom 0.254: 47.58,73.92 47.66,73.84 v47.92,73.84
  Bottom 0.406: U5.2 47.58,73.92 49.38,72.13 C13.2 49.76,72.25 47.44,74.58 U5.1
MOSI  (via drill 0.2, 0.2 pad 0.3)
  Top 0.254: v15.91,90.99 15.91,91.5 18.45,91.5 19.72,90.23 21.88,90.23 22.83,91.18 | 22.83,91.18 24.55,92.89 24.55,99.75 27.34,102.55 47.41,102.55 47.92,103.05 v49.31,103.05 | v23.66,90.35 22.83,91.18 | v23.91,87.69 23.91,86.67 26.71,83.88 26.71,83.37 25.18,81.84 25.18,80.57 25.47,80.29 | v15.91,84.64 16.25,84.97 X10.4
  Bottom 0.254: 53.1,104.55 51.6,103.05 v49.31,103.05 | v15.91,84.64 v15.91,90.99 | v23.91,87.69 23.91,90.1 v23.66,90.35
N$2  (1 unrouted)
  Bottom 0.254: 55.53,99.75 55.92,100.13 58,100.13 Y1.1 60.58,100.15 R31.1
N$3  (1 unrouted)
  Bottom 0.254: 55.58,98.95 56.43,98.1 57.97,98.1 arc90 Y1.3 59.53,98.15 59.89,98.52 R31.2
N$4  (via drill 0.3 pad 0.41)
  Top 0.406: v59.6,63.68 59.6,53.65 v59.09,53.14
  Bottom 0.406: v59.09,53.14 58.75,53.49 D14.+ | R5.2 59.6,65.34 v59.6,63.68
N$5  (via drill 0.3 pad 0.41)
  Top 0.406: v60.36,53.14 60.62,53.4 v60.62,64.57
  Bottom 0.305: R6.2 61.43,65.38
  Bottom 0.406: v60.36,53.14 60.57,53.35 D16.+ | 61.43,65.38 v60.62,64.57
N$6  (2 unrouted)
N$7
  Bottom 0.406: D17.+ R33.2
N$8  (1 unrouted)
  Bottom 0.61: 52.81,67.82 C31.2
  Bottom 0.813: 52.81,67.82 F2.1
N$9  (11 unrouted)
N$10  (2 unrouted)
N$11  (1 unrouted)
N$13  (2 unrouted)
N$20  (1 unrouted)
  Bottom 0.254: GD5.3 26.42,108.77 36.49,108.77 40.42,112.7 43.04,112.7 | 43.04,112.7 43.04,111.68 | R27.2 46.09,112.47 45.86,112.7 43.04,112.7
N$21
  Top 1.778: U$3.D3 89.57,41.2 89.57,79.08 U$3.D2
N$22
  Bottom 1.778: U$2.1 80.41,34.87 83.28,32 U$3.D4
N$28
  Bottom 1.27: D4.C 63.28,70.85 IC2.3
N$30
  Bottom 1.016: D3.C 35.76,37.32 IC1.3
N$32  (via drill 0.2, 0.3)
  Top 1.016: v52.87,63.68 52.87,60.76 49.57,57.46 44.49,57.46 39.79,52.76 33.95,52.76 32.93,51.74 32.93,49.84 33.57,49.2 34.58,49.2 35.22,48.57 35.22,32.19 36.74,30.66 v47.79,30.66
  Bottom 0.406: USB.P1 54.7,6.58 55.03,6.91
  Bottom 0.61: 55.03,6.91 55.54,7.42
  Bottom 0.813: 55.54,7.42 55.79,7.68 55.79,7.93
  Bottom 1.016: F2.2 53.55,63.68 v52.87,63.68 | v45.89,30.66 v47.79,30.66 46.39,30.66 50.2,26.85 55.79,26.85 55.79,7.93
N$33  (via drill 0.3)
  Top 0.406: v57.06,63.17 57.06,57.46 v57.57,56.95 | v56.17,44.12 56.17,42.6 54.14,40.57 46.01,40.57 44.62,39.17 44.62,37.65 45.38,36.89 46.39,36.89 54.01,29.27 v54.01,24.06
  Bottom 0.406: R59.1 58.33,64.44 v57.06,63.17 | v57.57,56.95 57.57,52.38 54.78,49.59 54.78,45.52 v56.17,44.12 | v54.01,24.06 54.01,9.2 54.04,9.17 USB.P2
N$34
  Bottom 0.254: GD5.1 23.32,109.36 24.42,108.26 36.74,108.26 40.15,111.67 R25.2
N$35
  Bottom 0.254: GD6.1 40.41,117.29 44.49,113.21 47.28,113.21 47.79,112.7 47.79,111.75 R28.2
N$36  (1 unrouted)
  Bottom 0.254: GD7.3 55.74,116.7 55.74,112.96 58.33,112.96 58.79,112.5 R37.2
N$40
  Bottom 0.254: GD7.1 52.63,118.92 54.22,117.33 R35.2
N$41
  pour Bottom (no thermals): 61.25,43.11 63.54,43.11 63.54,38.28 66.59,38.28 66.59,31.68 56.93,31.68 56.93,38.28 61.25,38.28
N$46  (1 unrouted)
  Bottom 0.254: GD8.3 65.14,113.57 65.14,113.09 | 65.14,113.09 R40.2 | 62.09,112.53 62.65,113.09 65.14,113.09
N$47  (1 unrouted)
  Bottom 0.305: U4.4 59.06,77.43 58.84,77.65 58.08,77.65 57.57,77.14 57.57,74.86 58.59,73.84 58.59,71.05 58.46,70.92
  Bottom 0.406: R6.1 R5.1 59.93,69.45 58.46,70.92 55.2,74.18 U4.20 50.85,74.18 50.57,74.46
  Bottom 0.813: D15.A 50.57,74.46 51.09,73.94 51.09,70.29 52.74,68.64 52.74,67.51
N$50
  Bottom 0.254: GD8.1 61.57,118.1 60.57,117.1 R38.2
N$51  (1 unrouted)
  Bottom 0.254: GD9.3 84.06,107.02 69.38,107.02 69.25,106.9 69.25,104.32 68.91,103.97 R43.2
N$55
  Bottom 0.254: GD9.1 74.23,111.33 71.45,108.55 R41.2
N$61
  Bottom 0.406: 78.52,39.68 78.52,39.64 78.52,39.05
  Bottom 1.778: U$2.2 74.43,36.22 77.25,39.05 78.52,39.05
N$62  (via drill 0.3)
  Top 0.406: v55.66,63.3 55.66,62.41 56.17,61.91 56.17,56.83 56.81,56.19 56.81,53.02 v56.43,52.63 | v53.12,24.95 53.12,29.01 46.08,36.06 44.93,36.06 43.73,37.27 43.73,39.43 45.63,41.33 53.63,41.33 54.39,42.09 v54.39,44.63
  Bottom 0.406: R60.1 56.83,64.47 v55.66,63.3 | v56.43,52.63 54.01,50.22 54.01,45.01 v54.39,44.63 | v53.12,24.95 53.12,9.2 53.38,8.95 USB.P3
N$66
  Bottom 1.778: DC1.+ 29.56,33.58 D2.A
N$73  (1 unrouted)
  Bottom 0.254: GD6.3 43.47,114.99 44.74,113.72 48.04,113.72 48.93,112.83 | 48.93,112.83 49.31,112.45 49.31,111.75 | R34.2 52.44,112.5 52.11,112.83 48.93,112.83
PB0  (1 unrouted)
PB1  (1 unrouted)
PB3  (1 unrouted)
PB4  (1 unrouted)
PC0  (via drill 0.2 pad 0.3)  (1 unrouted)
  Top 0.254: v46.9,104.83 46.9,105.97 48.17,107.24 v54.45,107.24
  Bottom 0.254: v46.91,104.84 v46.9,104.83 | R43.1 66.49,103.94 65.82,103.94 65.44,104.32 65.44,108.01 64.94,108.51 61.3,108.51 60.69,107.9 55.36,107.9 54.7,107.24 v54.45,107.24
PC1  (1 unrouted)
  Bottom 0.254: 46.11,107.5 48.55,107.5 49.06,108.01 54.39,108.01 54.9,108.51 60.36,108.51 61,109.15 64.94,109.15 65.19,109.4 65.19,110.1 R40.1
PC2  (1 unrouted)
  Bottom 0.254: 45.31,107.68 45.63,108.01 48.3,108.01 48.81,108.51 54.14,108.51 54.78,109.15 58.46,109.15 58.79,109.48 R37.1
PC3  (1 unrouted)
  Bottom 0.254: R34.1 52.44,109.48 52.11,109.15 48.68,109.15 48.04,108.51 44.87,108.51 44.51,108.15
PC4  (1 unrouted)
  Bottom 0.254: R27.1 46.09,109.48 45.63,109.02 43.35,109.02 42.71,108.39 42.71,104.55
PD3  (1 unrouted)
PD6  (1 unrouted)
RESET  (via drill 0.2, 0.3, 0.3 pad 0.41)  (5 unrouted)
  Top 0.254: v24.42,91.11 25.09,90.45 27.47,90.45 27.47,97.97 v26.71,98.73 | 22.9,100 26.45,103.56 46.77,103.56 47.66,104.45 47.66,105.59 48.81,106.74 53.76,106.74 56.17,104.32 v56.17,102.16 56.17,101.28 57.19,100.26 57.19,96.32 v56.81,95.94 | 22.9,100 17.56,100 12.48,94.92 v12.48,92.38 | v10.83,88.45 v10.83,85.65 | 22.9,100 v22.9,98.73 | v61.63,79.3 61.63,91.02 59.89,92.77 v57.95,92.77
  Bottom 0.254: v26.71,98.73 v22.9,98.73 | v12.48,92.38 12.48,90.1 v10.83,88.45 | v24.42,91.11 24.68,90.86 24.68,86.8 22.81,86.8 X10.5 | 5.25,27.82 5.25,33.84 7.53,36.12 15.28,36.12 17.56,38.41 17.56,50.22 19.22,51.87 26.07,51.87 28.74,54.54 28.74,67.24 27.34,68.64 19.85,68.64 17.18,71.3 17.18,81.08 12.61,85.65 v10.83,85.65 | v56.81,95.94 56.81,94.83 | 56.16,102.15 v56.17,102.16 56.17,104.32 56.95,105.1 | U4.11 61.63,72.88 v61.63,79.3
  Bottom 0.305: 57.48,93.24 v57.95,92.77
RXI  (via drill 0.3 pad 0.41)
  Top 0.254: 2.68,85.3 4.48,83.5 14.9,83.5 19.72,78.67 21.5,78.67 25.57,74.61 25.57,73.08 27.72,70.92 v28.23,70.92 | v30.52,69.65 32.04,69.65 32.8,70.41 33.82,70.41 39.41,76 39.41,83.75 v40.42,84.77
  Top 0.305: v48.04,84.77 54.63,78.18 57.04,78.18 v58.46,76.76
  Bottom 0.254: v28.23,70.92 29.5,69.65 v30.52,69.65
  Bottom 0.305: v58.46,76.76 60.19,76.76 U4.5 | v48.04,84.77 v40.42,84.77
RXLED  (via drill 0.3 pad 0.41)
  Top 0.305: v57.57,73.59 58.71,72.45 v58.71,58.22
  Bottom 0.305: 60.57,55.86 D16.- 60.62,55.81 | U4.22 55.17,75.48 57.06,73.59 v57.57,73.59
  Bottom 0.406: v58.71,58.22 59.73,58.22 60.62,57.33 60.62,55.81
SCK  (via drill 0.2, 0.2 pad 0.3, 0.3 pad 0.41)
  Top 0.254: v49.31,101.53 28.11,101.53 25.82,99.24 25.82,92.77 v25.95,92.64 | X10.3 23.91,84.97 25.18,83.7 v25.18,83.11 | 25.27,78.92 25.06,78.92 23.66,80.32 v23.66,81.21
  Bottom 0.254: 53.27,102.95 51.85,101.53 v49.31,101.53 | v25.95,92.64 25.95,91.62 25.82,91.5 25.82,83.75 v25.18,83.11 23.66,81.59 v23.66,81.21
TRIPOT_IR_EN  (3 unrouted)
TXLED  (via drill 0.3 pad 0.41)
  Top 0.305: v56.55,76.13 56.55,73.21 58.08,71.68 58.08,58.86 57.82,58.6 57.82,57.84 58.59,57.08 v58.71,57.08
  Bottom 0.305: U4.23 v56.55,76.13 | 58.71,55.8 D14.-
  Bottom 0.406: v58.71,57.08 58.71,55.8
TXO  (via drill 0.3 pad 0.41)
  Top 0.254: 14.35,84.81 20.1,79.18 21.88,79.18 26.07,74.86 26.07,73.46 27.72,71.81 v29.38,71.81 | v31.53,70.54 31.92,70.92 33.44,70.92 38.77,76.26 38.77,84.26 v40.42,85.91
  Top 0.305: v52.74,81.34 48.17,85.91 v47.28,85.91
  Bottom 0.254: v29.38,71.81 30.65,70.54 v31.53,70.54
  Bottom 0.305: U4.1 54.7,79.38 v52.74,81.34 | v47.28,85.91 v40.42,85.91
USB_D+
  Bottom 0.406: U4.15 55.4,70.93 56.81,69.53 56.81,67.21 R60.2
USB_D-
  Bottom 0.406: U4.16 56.53,71.58 58.33,69.78 R59.2
VBAT  (1 unrouted)
VIN_B  (1 unrouted)
  Bottom 0.406: 65.88,46.23 66.46,45.65 71.03,45.65 70.52,45.39
  Bottom 1.016: 73.67,44.5 73.67,45.39 70.52,45.39 70.52,34.94
  Bottom 1.778: 70.52,34.94 70.52,31.68 82.33,19.87 86.98,19.87 SW1.COM2 SW1.COM1
VIN_C  (via drill 0.3, 0.3 pad 0.41)  (5 unrouted)
  Top 1.778: 64.16,63.56 v62.01,63.56 62.01,50.63 v58.2,50.63 57.95,50.63 | v57.95,44.51 57.95,50.63 | 57.95,50.63 38.77,50.63 | 38.77,50.63 38.27,50.63 v38.27,35.11 37.16,35.11 | v34.96,50.98 v36.36,50.98 38.42,50.98 38.77,50.63
  Bottom 0.254: 39.15,75.11 39.22,75.05 U5.24 | 34.07,67.87 34.07,67.42 U5.13
  Bottom 0.406: 57.38,49.8 v58.2,50.63
  Bottom 0.61: v63.16,63.56 v64.3,63.56 | 39.15,75.11 39.15,76.64 42.14,79.63 C16.A
  Bottom 1.778: 57.96,44.49 arc90 v57.95,44.51 | 64.16,63.56 v63.16,63.56 v62.01,63.56 | 34.07,67.87 30.65,67.87 30.65,53.52 33.08,51.09 33.08,50.98 v36.36,50.98 | v38.27,35.11 v37.04,35.11 34.37,35.11 34.37,33.93
  pour Bottom (no thermals): 40.3,75.37 35.98,75.37 33.57,67.11 40.42,67.11

### Text on the board
tPlace: MAZEBOT | www.duinofun.com | PC4 | PC5 | PC6 | PC7 | Buzzer | 2014/10/10 | V0.6 dy QXZ | DC-6V | POWER | RESET | USB